# EAGLE design interface (EAGLE 6.1)
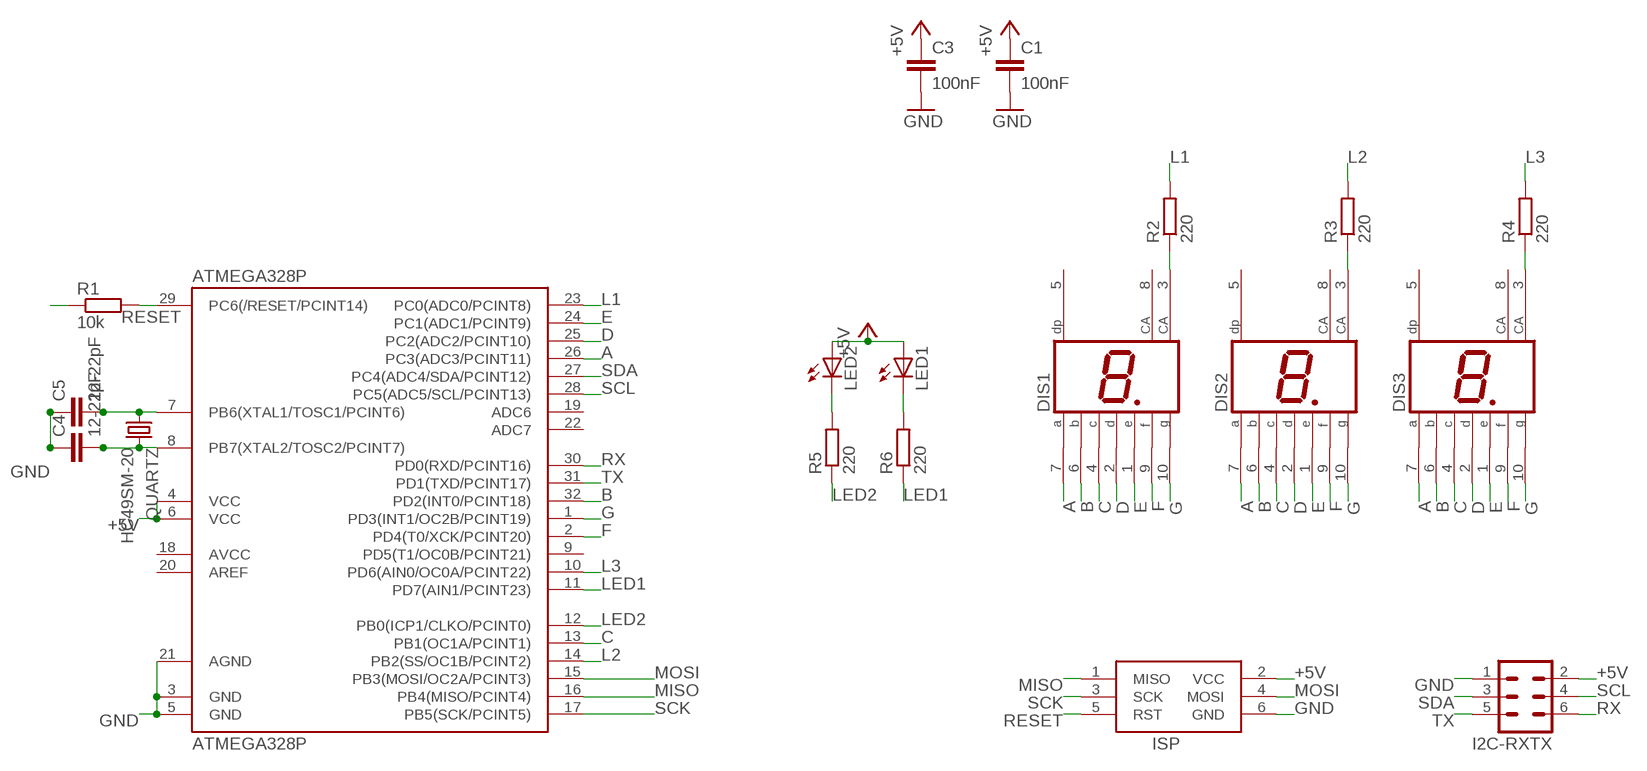
[diagram p0: schematic, sheet 1]

## Parts
ATMEGA328P  ATMEGA328P  MEGA48/88/168-AU  [TQFP32-08]
C1  100nF  C-EUC0805  [C0805]
C3  100nF  C-EUC0805  [C0805]
C4  12-22pF  C-EUC0805  [C0805]
C5  12-22pF  C-EUC0805  [C0805]
DIS1  HD-H101  [HDSP-M]
DIS2  HD-H101  [HDSP-M]
DIS3  HD-H101  [HDSP-M]
I2C-RXTX  MA03-2  [MA03-2]
ISP  AVRISP-6  [AVRISP]
LED1  LED5MM  [LED5MM]
LED2  LED5MM  [LED5MM]
QUARTZ  HC49SM-20  CRYSTALHC49UP  [HC49UP]
R1  10k  R-EU_R0805  [R0805]
R2  220  R-EU_R0805  [R0805]
R3  220  R-EU_R0805  [R0805]
R4  220  R-EU_R0805  [R0805]
R5  220  R-EU_R0805  [R0805]
R6  220  R-EU_R0805  [R0805]

## Nets
+5V: ATMEGA328P.4(VCC) ATMEGA328P.6(VCC) C1.1 C3.1 I2C-RXTX.2 ISP.2(VCC) LED1.A LED2.A R1.1
A: ATMEGA328P.26(PC3(ADC3/PCINT11)) DIS1.7(A) DIS2.7(A) DIS3.7(A)
B: ATMEGA328P.32(PD2(INT0/PCINT18)) DIS1.6(B) DIS2.6(B) DIS3.6(B)
C: ATMEGA328P.13(PB1(OC1A/PCINT1)) DIS1.4(C) DIS2.4(C) DIS3.4(C)
D: ATMEGA328P.25(PC2(ADC2/PCINT10)) DIS1.2(D) DIS2.2(D) DIS3.2(D)
E: ATMEGA328P.24(PC1(ADC1/PCINT9)) DIS1.1(E) DIS2.1(E) DIS3.1(E)
F: ATMEGA328P.2(PD4(T0/XCK/PCINT20)) DIS1.9(F) DIS2.9(F) DIS3.9(F)
G: ATMEGA328P.1(PD3(INT1/OC2B/PCINT19)) DIS1.10(G) DIS2.10(G) DIS3.10(G)
GND: ATMEGA328P.3(GND) ATMEGA328P.5(GND) ATMEGA328P.21(AGND) C1.2 C3.2 C4.1 C5.1 I2C-RXTX.1 ISP.6(GND)
L1: ATMEGA328P.23(PC0(ADC0/PCINT8)) R2.2
L2: ATMEGA328P.14(PB2(SS/OC1B/PCINT2)) R3.2
L3: ATMEGA328P.10(PD6(AIN0/OC0A/PCINT22)) R4.2
LED1: ATMEGA328P.11(PD7(AIN1/PCINT23)) R6.1
LED2: ATMEGA328P.12(PB0(ICP1/CLKO/PCINT0)) R5.1
MISO: ATMEGA328P.16(PB4(MISO/PCINT4)) ISP.1(MISO)
MOSI: ATMEGA328P.15(PB3(MOSI/OC2A/PCINT3)) ISP.4(MOSI)
N$1: ATMEGA328P.8(PB7(XTAL2/TOSC2/PCINT7)) C4.2 QUARTZ.2
N$2: ATMEGA328P.7(PB6(XTAL1/TOSC1/PCINT6)) C5.2 QUARTZ.1
N$3: DIS2.3(CA) R3.1
N$4: DIS3.3(CA) R4.1
N$5: LED2.K(C) R5.2
N$6: DIS1.3(CA) R2.1
N$7: LED1.K(C) R6.2
RESET: ATMEGA328P.29(PC6(/RESET/PCINT14)) ISP.5(RST) R1.2
RX: ATMEGA328P.30(PD0(RXD/PCINT16)) I2C-RXTX.6
SCK: ATMEGA328P.17(PB5(SCK/PCINT5)) ISP.3(SCK)
SCL: ATMEGA328P.28(PC5(ADC5/SCL/PCINT13)) I2C-RXTX.4
SDA: ATMEGA328P.27(PC4(ADC4/SDA/PCINT12)) I2C-RXTX.3
TX: ATMEGA328P.31(PD1(TXD/PCINT17)) I2C-RXTX.5
Unconnected: ATMEGA328P.9(PD5(T1/OC0B/PCINT21)) ATMEGA328P.18(AVCC) ATMEGA328P.19(ADC6) ATMEGA328P.20(AREF) ATMEGA328P.22(ADC7) DIS1.5(DP) DIS1.8(CA) DIS2.5(DP) DIS2.8(CA) DIS3.5(DP) DIS3.8(CA)

## Library data of the parts
ATMEGA328P = avr-6:MEGA48/88/168
C1 C3-C5 = rcl:C-EU: CAPACITOR, European symbol
DIS1-DIS3 = display-hp:HD-H101: LED DISPLAY 1-character 7 segment, decimal point right; OC_FARNELL: unknown; OC_NEWARK: unknown
I2C-RXTX = con-lstb:MA03-2: PIN HEADER; OC_FARNELL: unknown; OC_NEWARK: unknown
ISP = adafruit:AVRISP: AVR ISP HEADER Standard 6 pin header for AVR programming
LED1 LED2 = adafruit:LED: LED OSRAM: - CHIPLED LG R971, LG N971, LY N971, LG Q971, LY Q971, LO R971, LY R971 LH N974, LH R974 LS Q976, LO Q976, LY Q976 LO Q996 - Hyper CHIPLED LW Q18S LB Q993, LB Q99A, LB R99A - SideLED LS A670, LO A670, LY A670, LG A670, LP A670 LB A673, LV A673, LT A673, LW A673 LH A674 LY A675 LS A676, LA A676, LO A676, LY A676, LW A676 LS A679, LY A679, LG A679 - Hyper Micro SIDELED® LS Y876, LA Y876, LO Y876, LY Y876 LT Y87S - SmartLED LW L88C, LW L88S LB L89C, LB L89S, LG L890 LS L89K, LO L89K, LY L89K LS L896, LA L896, LO L896, LY L896 - TOPLED LS T670, LO T670, LY T670, LG T670, LP T670 LSG T670, LSP T670, LSY T670, LOP T670, LYG T670 LG T671, LOG T671, LSG T671 LB T673, LV T673, LT T673, LW T673 LH T674 LS T676, LA T676, LO T676, LY T676, LB T676, LH T676, LSB T676, LW T676 LB T67C, LV T67C, LT T67C, LS T67K, LO T67K, LY T67K, LW E67C LS E67B, LA E67B, LO E67B, LY E67B, LB E67C, LV E67C, LT E67C LW T67C LS T679, LY T679, LG T679 LS T770, LO T770, LY T770, LG T770, LP T770 LB T773, LV T773, LT T773, LW T773 LH T774 LS E675, LA E675, LY E675, LS T675 LS T776, LA T776, LO T776, LY T776, LB T776 LHGB T686 LT T68C, LB T68C - Hyper Mini TOPLED® LB M676 - Mini TOPLED Santana® LG M470 LS M47K, LO M47K, LY M47K Source: http://www.osram.convergy.de/
QUARTZ = crystal:CRYSTAL: CRYSTAL; OC_FARNELL: unknown; OC_NEWARK: unknown
R1-R6 = rcl:R-EU_: RESISTOR, European symbol

## Board
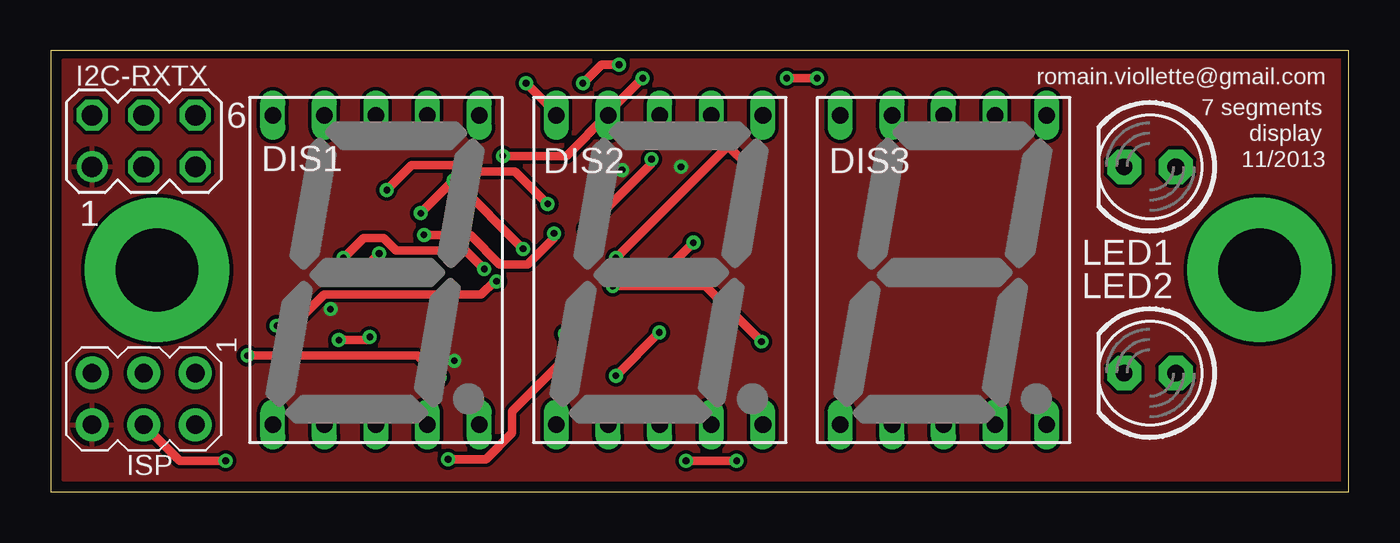
[diagram p1: board, top side]
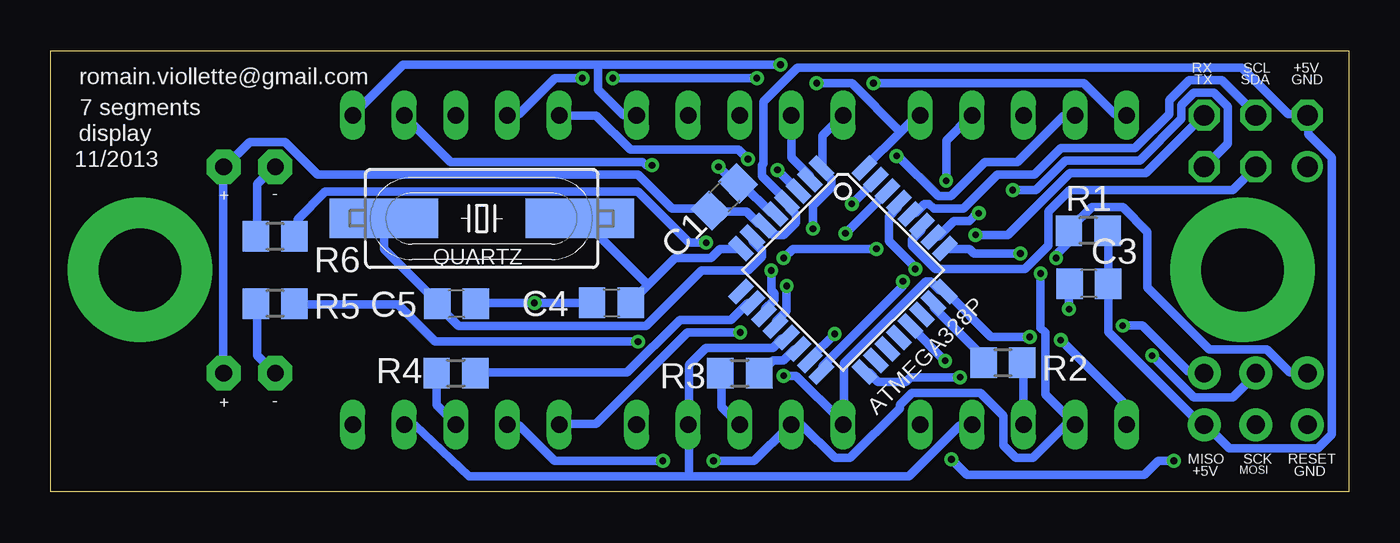
[diagram p2: board, bottom side, seen from below]

Size 63.88 x 21.72 mm. Coordinates in mm from the lower left corner, seen from the top.
Outline: 0,0 63.88,0 63.88,21.72 0,21.72 0,0
Copper layers (1*16): Top 0.0356mm / dielectric 1.5011mm / Bottom 0.0356mm
Design rules: minimum track width 16mil, minimum drill 13mil, track to track 6mil, track to pad 6mil, pad to pad 6mil, via to via 6mil, smd to smd 6mil, copper to edge 15mil, drill to drill 6mil, minimum pad ring 7mil, minimum via ring 7mil, stop-mask expansion 3mil, vias tented up to drill 0mil, thermal gap 10mil
vRestrict: area 18.4,10.4 to 25.3,17.3; area 24.4,4.6 to 31.2,11.4; area 18.6,4.6 to 25.4,11.4; area 24.4,10.4 to 31.2,17.3

### Footprints (pad centres in the part's own frame; a part is rotated, then mirrored left to right if it is on the bottom)
TQFP32-08 = smd 1.27 x 0.559: 1 -4.293,2.8; 2 -4.293,2; 3 -4.293,1.2; 4 -4.293,0.4; 5 -4.293,-0.4; 6 -4.293,-1.2; 7 -4.293,-2; 8 -4.293,-2.8; 17 4.293,-2.8; 18 4.293,-2; 19 4.293,-1.2; 20 4.293,-0.4; 21 4.293,0.4; 22 4.293,1.2; 23 4.293,2; 24 4.293,2.8 | smd 0.559 x 1.27: 9 -2.8,-4.293; 10 -2,-4.293; 11 -1.2,-4.293; 12 -0.4,-4.293; 13 0.4,-4.293; 14 1.2,-4.293; 15 2,-4.293; 16 2.8,-4.293; 25 2.8,4.293; 26 2,4.293; 27 1.2,4.293; 28 0.4,4.293; 29 -0.4,4.293; 30 -1.2,4.293; 31 -2,4.293; 32 -2.8,4.293
C0805 = smd 1.3 x 1.5: 1 -0.95,0; 2 0.95,0
HDSP-M = drill 0.813 long: 1 -5.08,-7.62; 2 -2.54,-7.62; 3 0,-7.62; 4 2.54,-7.62; 5 5.08,-7.62; 6 5.08,7.62; 7 2.54,7.62; 8 0,7.62; 9 -2.54,7.62; 10 -5.08,7.62
MA03-2 = drill 1.016: 1 -2.54,-1.27 | drill 1.016 octagon: 2 -2.54,1.27; 3 0,-1.27; 4 0,1.27; 5 2.54,-1.27; 6 2.54,1.27
AVRISP = drill 0.9 pad 1.626: 1 -1.27,2.54; 2 1.27,2.54; 3 -1.27,0; 4 1.27,0; 5 -1.27,-2.54; 6 1.27,-2.54
LED5MM = drill 0.813 pad 1.676 octagon: A -1.27,0; K 1.27,0
HC49UP = smd 5.334 x 1.93: 1 -4.826,0; 2 4.826,0
R0805 = smd 1.3 x 1.5: 1 -0.95,0; 2 0.95,0

### Placement (x,y rotation side)
ATMEGA328P  24.89,10.92 315 bottom
C1  30.73,14.52 45 bottom
C3  12.79,10.25 180 bottom
C4  36.29,9.31 0 bottom
C5  43.9,9.26 180 bottom
DIS1  16,10.92 0 top
DIS2  29.97,10.92 0 top
DIS3  43.94,10.92 0 top
I2C-RXTX  4.57,17.27 0 top
ISP  4.57,4.57 270 top
LED1  54.1,16 180 top
LED2  54.1,5.84 180 top
QUARTZ  42.67,13.46 0 bottom
R1  12.82,12.86 180 bottom
R2  17.02,6.35 180 bottom
R3  29.97,5.84 0 bottom
R4  43.94,5.84 0 bottom
R5  52.83,9.27 180 bottom
R6  52.83,12.57 180 bottom

### Tracks (layer width: path | path; a pad name or v marks a point on that pad's centre or on a via)
+5V
  Bottom 0.406: LED2.A 55.4,5.87 55.4,15.85 LED1.A 55.32,16 54.1,17.22 52.35,17.22 50.75,15.62 34.98,15.62 33.3,13.95 31.55,13.95 C1.1 31.39,13.79 29.64,13.79 29.03,13.18 28.8,13.18 ATMEGA328P.6 28.65,12.95 28.35,12.65 27.81,12.65 27.2,13.26 27.2,13.64 27.58,14.02 27.58,14.17 ATMEGA328P.4 27.74,14.4 28.88,15.54 28.88,16.08 28.8,16.15 28.8,19.2 27.13,20.88 5.26,20.88 2.97,18.59 2.21,18.59 I2C-RXTX.2 1.98,18.52 1.98,17.6 0.84,16.46 0.84,2.82 1.52,2.13 5.87,2.13 6.93,3.2 ISP.2 7.32,3.35 11.84,7.87 11.84,10.06 C3.1 11.84,10.26 11.84,12.85 R1.1
A  (via drill 0.33)
  Top 0.406: v18.21,13.72 v19.81,15.32 19.96,15.24 v23.24,11.96 | v34.29,16.08 33.34,17.03 | 33.34,17.03 32.54,17.83 32.54,18.52 DIS2.7 | 33.34,17.03 v27.81,11.51
  Bottom 0.406: v18.21,13.72 18.29,13.72 18.67,13.34 19.43,13.34 20.19,12.57 20.42,12.57 ATMEGA328P.26 | v19.81,15.32 19.81,17.3 18.59,18.52 DIS1.7 | v34.29,16.08 34.59,16.08 34.75,16.23 44.2,16.23 46.48,18.52 DIS3.7 | v23.24,11.96 27.36,11.96 v27.81,11.51
B  (via drill 0.33)
  Top 0.406: v26.19,20.12 27.1,21.03 v27.96,21.03
  Bottom 0.406: 22.06,17.72 21.26,18.52 21.11,18.52 DIS1.6 | 22.06,17.72 23.77,16 ATMEGA328P.32 | 49,18.59 DIS3.6 46.53,21.03 36.96,21.03 | 22.06,17.72 24.46,20.12 v26.19,20.12 | v27.96,21.03 36.96,21.03 | DIS2.6 35.69,18.54 36.96,19.81 36.96,21.03
C
  Bottom 0.406: ATMEGA328P.13 27.66,7.54 27.89,7.54 28.35,7.09 31.62,7.09 32.46,6.25 32.46,3.35 DIS2.4 32.46,3.12 32.46,0.76 | 32.46,0.76 21.64,0.76 19.13,3.28 18.59,3.28 DIS1.4 | DIS3.4 46.48,3.28 45.95,3.28 43.28,0.76 32.46,0.76
D  (via drill 0.33)
  Top 0.406: v15.16,10.74 v16.15,11.73 | v31.27,1.52 v33.76,1.52
  Bottom 0.406: v16.15,11.73 18.44,11.73 18.67,11.96 19.81,11.96 ATMEGA328P.25 | v15.16,10.74 15.16,8.08 14.94,7.85 14.94,4.8 13.49,3.35 DIS1.2 13.79,3.43 15.54,1.68 16.38,1.68 16.99,2.29 16.99,3.73 18.14,4.88 21.49,4.88 22.1,4.27 22.1,4.12 24.54,1.68 25.3,1.68 26.9,3.28 27.43,3.28 DIS2.2 27.58,3.2 29.26,1.52 v31.27,1.52 | v33.76,1.52 39.09,1.52 40.84,3.28 41.38,3.28 DIS3.2
E  (via drill 0.33)
  Top 0.406: v14.17,7.47 15.54,7.47 v15.7,7.62 | v27.81,5.71 v29.95,7.85
  Bottom 0.406: v14.17,7.47 10.97,4.27 10.97,3.35 DIS1.1 | v15.7,7.62 17.6,7.62 19.74,9.75 ATMEGA328P.24 19.89,9.91 20.12,9.91 20.57,10.36 20.8,10.36 24.84,6.33 24.84,3.35 DIS2.1 24.99,3.5 27.2,5.71 v27.81,5.71 | v29.95,7.85 32.54,7.85 37.03,3.35 38.86,3.35 DIS3.1
F  (via drill 0.33)
  Top 0.406: v22.25,16.54 25.38,16.54 27.43,18.59 DIS2.9 27.51,18.75 v29.13,20.37 | v36.22,20.37 v37.72,20.37
  Bottom 0.406: DIS2.9 27.43,16.46 26.52,15.54 26.52,15.39 ATMEGA328P.2 | v22.25,16.54 22.17,16.54 20.19,14.55 19.58,14.55 17.91,16.23 16.31,16.23 14.02,18.52 13.49,18.52 DIS1.9 | v29.13,20.37 v36.22,20.37 | DIS3.9 41.38,18.59 40.84,18.59 39.06,20.37 v37.72,20.37
G  (via drill 0.33)
  Top 0.406: v23.39,20.12 24.92,18.59 DIS2.10 | v29.57,16.38 29.57,16.15 v26.36,12.95
  Bottom 0.406: DIS2.10 25.91,17.53 25.91,16 ATMEGA328P.1 25.83,15.77 25.45,15.39 25.45,15.01 26.36,14.1 v26.36,12.95 | v23.39,20.12 13.03,20.12 11.51,18.59 10.97,18.59 DIS1.10 | v29.57,16.38 30.02,16.84 35.36,16.84 37.03,18.52 38.86,18.52 DIS3.10
GND  (via drill 0.33)
  Bottom 0.406: C5.1 42.9,9.3 v40.08,9.3 37.26,9.3 C4.1 | ATMEGA328P.5 28.27,13.72 28.42,13.72 29.87,15.16 30.02,15.16 C1.2 30.25,15.24 v31.01,16 | v19.86,6.45 21.57,8.15 ATMEGA328P.21 | v28.12,15.85 27.13,14.86 ATMEGA328P.3 | v13.77,8.99 13.77,10.21 C3.2
  pour Top (isolate 0.178): 0.64,21.21 0.64,0.64 63.5,0.64 63.5,21.21
HOLE1  (via drill 4.06 pad 7.11)
  other vias: 5.23,10.92
HOLE2  (via drill 4.06 pad 7.11)
  other vias: 59.49,10.92
L1
  Bottom 0.406: ATMEGA328P.23 20.42,9.3 20.42,9.07 17.98,6.63 17.98,6.4 R2.2
L2
  Bottom 0.406: ATMEGA328P.14 27.13,7.01 27.28,7.01 27.81,6.48 28.35,6.48 28.96,5.87 R3.2
L3
  Bottom 0.406: ATMEGA328P.10 29.41,9.3 29.57,9.3 30.4,8.46 32.92,8.46 35.51,5.87 42.98,5.87 R4.2
LED1  (via drill 0.33)
  Top 0.406: v28.42,10.9 30.25,10.9 v31.62,12.27
  Bottom 0.406: v28.42,10.9 28.42,9.91 28.27,9.75 28.27,9.45 28.73,8.99 28.73,8.76 ATMEGA328P.11 | 51.82,12.57 R6.1 51.74,12.72 51.74,13.41 50.37,14.78 34.98,14.78 32.46,12.27 v31.62,12.27
LED2  (via drill 0.33)
  Top 0.406: v27.66,10.13 32.23,10.13 v34.98,7.39
  Bottom 0.406: v27.66,10.13 27.66,8.91 28.19,8.38 28.19,8.23 ATMEGA328P.12 | v34.98,7.39 44.96,7.39 46.79,9.22 51.82,9.22 R5.1
MISO  (via drill 0.33)
  Top 0.406: v11.12,8.18 11.94,8.18 13.46,9.7 21.18,9.7 21.84,10.36 v21.95,10.36
  Bottom 0.406: v21.95,10.36 21.95,10.13 25.91,6.17 25.91,5.94 ATMEGA328P.16 | 7.16,5.87 ISP.1 7.37,5.89 7.87,5.89 10.16,8.18 v11.12,8.18
MOSI  (via drill 0.33)
  Top 0.406: v25.3,7.77 25.3,6.55 22.71,3.96 22.71,2.9 21.41,1.6 v19.56,1.6 | ISP.4 6.35,1.52 v8.61,1.52
  Bottom 0.406: v25.3,7.77 26.44,6.63 26.44,6.48 ATMEGA328P.15 | v19.56,1.6 18.8,0.84 10.06,0.84 9.37,1.52 v8.61,1.52
N$1
  Bottom 0.406: 34.48,10.17 35.28,9.37 C4.2 | 34.48,10.17 33.15,11.51 31.39,11.51 30.94,11.96 29.95,11.96 ATMEGA328P.8 | 34.48,10.17 37.8,13.49 QUARTZ.2
N$2
  Bottom 0.406: ATMEGA328P.7 29.34,12.5 29.34,12.34 28.88,11.89 28.88,11.58 29.57,10.9 31.85,10.9 34.59,8.15 43.81,8.15 44.88,9.22 C5.2 44.96,9.45 47.47,11.96 47.47,13.41 QUARTZ.1
N$3
  Bottom 0.406: DIS2.3 30.86,4.19 30.86,5.79 R3.1
N$4
  Bottom 0.406: R4.1 44.88,5.79 44.88,4.27 43.97,3.35 DIS3.3
N$5
  Bottom 0.406: R5.2 53.72,9.22 53.72,6.71 52.88,5.87 LED2.K
N$6
  Bottom 0.406: DIS1.3 16,6.33 R2.1
N$7
  Bottom 0.406: R6.2 53.72,12.57 53.72,15.16 52.88,16 LED1.K
RESET  (via drill 0.33)
  Top 0.406: v21.34,10.97 20.42,11.89 16.99,11.89 16.38,12.5 15.39,12.5 v14.4,11.51
  Bottom 0.406: v21.34,10.97 21.34,11.05 22.63,12.34 22.63,13.56 22.17,14.02 22.17,14.17 ATMEGA328P.29 | v14.4,11.51 14.4,11.66 13.79,12.27 13.79,12.8 R1.2 13.64,13.03 12.65,14.02 11.12,14.02 9.91,12.8 9.91,10.06 6.86,7.01 4.04,7.01 2.9,5.87 2.06,5.87 ISP.5
RX  (via drill 0.33)
  Top 0.406: v24.77,12.72 24.77,12.5 23.47,11.2 22.1,11.2 20.65,12.65 v18.36,12.65
  Bottom 0.406: v24.77,12.72 22.71,14.78 ATMEGA328P.30 | v18.36,12.65 16.76,12.65 13.72,15.7 9.98,15.7 7.16,18.52 I2C-RXTX.6
SCK  (via drill 0.33)
  Top 0.406: v19.13,5.64 18.06,6.71 v9.68,6.71
  Bottom 0.406: v19.13,5.64 21.57,5.64 21.79,5.41 23.16,5.41 23.62,5.87 23.77,5.87 ATMEGA328P.17 | v9.68,6.71 7.62,4.65 5.71,4.65 4.57,5.79 ISP.3
SCL
  Bottom 0.406: ATMEGA328P.28 21.57,13.72 21.34,13.72 20.88,14.17 20.65,14.17 20.42,13.95 18.97,13.95 17.3,15.62 15.47,15.62 14.17,16.92 10.52,16.92 8.84,18.59 8.84,19.28 7.85,20.27 6.25,20.27 4.57,18.59 I2C-RXTX.4
SDA
  Bottom 0.406: I2C-RXTX.3 5.71,14.86 13.72,14.86 14.78,13.79 14.78,12.12 15.93,10.97 20.34,10.97 21.49,12.12 21.49,12.42 21.03,12.88 21.03,13.11 ATMEGA328P.27
TX  (via drill 0.33)
  Top 0.406: v24.46,14.17 22.86,15.77 20.34,15.77 20.04,16.08 17.75,16.08 v16.54,14.86
  Bottom 0.406: v24.46,14.17 23.32,15.32 ATMEGA328P.31 | v16.54,14.86 15.39,14.86 13.95,16.31 10.29,16.31 8.23,18.36 8.23,19.05 7.62,19.66 6.63,19.66 5.94,18.97 5.94,17.14 7.09,16 I2C-RXTX.5

### Text on the board
_tsilk: romain.viollette@gmail.com | 7 segments | display | 11/2013
_bsilk: +5V | SCL | RX | GND | SDA | TX | romain.viollette@gmail.com | 7 segments | display | 11/2013 | - | + | - | + | GND | RESET | SCK | MOSI | +5V | MISO